# Altium schematic sheet Boost convertor.SchDoc
size A; SheetNumber: 1; SheetTotal: 1
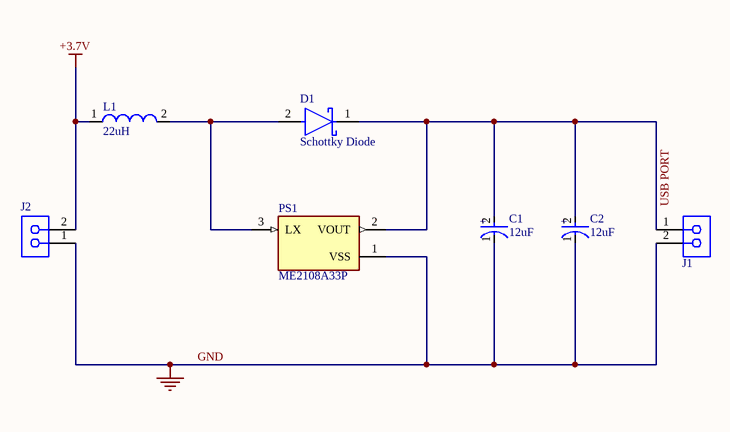
[diagram p0: Boost convertor.SchDoc]

## Parts
C1  12uF  [FP-RAD-TH-D_5_0_5-L_7_1-F-MFG]
C2  12uF  [FP-RAD-TH-D_5_0_5-L_7_1-F-MFG]
D1  Schottky Diode  [FP-DO-41-MFG]
J1  SSW-102-02-T-S  [SMTC-SSW-102-02-X-S]  (value not drawn)
J2  SSW-102-02-T-S  [SMTC-SSW-102-02-X-S]  (value not drawn)
L1  22uH  [WE-TIS 1111]
PS1  ME2108A33P  [CONV_ME2108A33P]

## Nets
+3.7V: J2.2 L1.1
GND: C1.1(C) C2.1(C) J1.2 J2.1 PS1.1(VSS)
USB PORT: C1.2(A) C2.2(A) D1.1(C) J1.1 PS1.2(VOUT)
NetD1_2: D1.2(A) L1.2 PS1.3(LX)

## Notes on the sheet
- (in symbol CMP-05427-000166-1) +

## Library data of the parts
C1 C2 = CMP-05427-000166-1: Aluminum Electrolytic Capacitors (Radial Lead Type) AEC-Q200 Qualified 12uF ±20% 35V; Impedance: 950mR; Leakage Current: 3uA; Ripple Current: 120mA; Lead Diameter: 0.45mm; Life (Hours): 1000Hour; Voltage: 35V; Lead Pitch: 2mm; Capacitance: 12uF; Radiation Hardening: No; Construction: RADIAL; RoHS Compliant: Yes; Voltage Rating: 35V; Length: 7mm; Min Operating Temperature: -55°C; Tolerance: 20%; Height - Seated (Max): 0.315inch; Height: 7mm; Case/Package: Radial; Termination: Radial; Diameter: 5mm; Packaging: Bulk; ESR (Equivalent Series Resistance): 950mR; Mount: Through Hole; Package Quantity: 200; Series: FC; Voltage Rating (DC): 35V; Max Operating Temperature: 105°C
D1 = CMP-12187-000037-1: DIODE SCHOTTKY 20V 1A DO41; Max Forward Surge Current (Ifsm): 25A; Forward Voltage: 450mV; Max Reverse Leakage Current: 500uA; Element Configuration: Single; Polarity: Standard; Capacitance: 110pF; Length: 5.2mm; Min Operating Temperature: -65°C; Series: -; Packaging: Cut Tape; Output Current: 1A; RoHS Compliant: Yes; Max Surge Current: 25A; Voltage Rating (DC): 20V; Number of Pins: 2; Width: 2.7mm; Max Reverse Voltage (DC): 20V; Height: 2.7mm; Weight: 0.01lb; Max Operating Temperature: 150°C; Current Rating: 1A; Lead Free: Lead Free; Case/Package: DO-41; Radiation Hardening: No; Package Quantity: 2000; Forward Current: 1A; Max Repetitive Reverse Voltage (Vrrm): 20V; Peak Non-Repetitive Surge Current: 25A; REACH SVHC: No SVHC; Average Rectified Current: 1A; Max Reverse Current: 500uA; Mount: Through Hole
J1 J2 = CMP-1023-00323-1: SQ Post Socket, Through-hole, Vertical, -55 to 105 degC, 2.54 mm Pitch, 2-Pin, Female, RoHS; Manufacturer: Samtec; Pitch: 2.54 mm; ComponentLink3Description: Package Specification; ComponentLink2Description: Datasheet; ComponentLink1Description: Manufacturer URL; PackageVersion: CA, 6/1987; DatasheetVersion: F-214; PackageDescription: Assembly, Socket Strip .016 X .031 Tail; ComponentLink2URL: http://www.samtec.com/documents/webfiles/pdf/SSW_TH.PDF; RoHS: True; ComponentLink3URL: http://www.samtec.com/documents/webfiles/cpdf/SSW-1XX-XX-XXX-X-XX-XXX-XX-MKT.pdf; ComponentLink1URL: http://www.samtec.com; PackageReference: SSW-102-02-X-S; Mounting Technology: Through-hole; Orientation: Vertical; Temperature Range: -55 to 105 degC; PartNumber: SSW-102-02-T-S
L1 = CMP-1406-00020-1: Shielded Radial Leaded Wire Wound Inductor WE-TIS, L=22.0 µH; PartNumber: 7447471220; Manufacturer: Wuerth Elektronik; Inductance: 22.0 ÂµH; ComponentLink2Description: Datasheet; PackageReference: WE-TIS 1111; ComponentLink1Description: Manufacturer URL; ComponentLink2URL: http://www.we-online.de/katalog/media/pdf/7447471220.pdf; ComponentLink1URL: http://www.we-online.com
PS1 = ME2108A33P: PFM Step-up Step-up Step-up Step-up DC/DC Converter; MF: Nanjing Micro One Electronics; Price: None; SnapEDA_Link: https://www.snapeda.com/parts/ME2108A33P/Nanjing%20Micro%20One%20Electronics/view-part/4258047/?ref=snap; MP: ME2108A33P; Value: *; Availability: Unavailable; Package: Package; Check_prices: https://www.snapeda.com/parts/ME2108A33P/Nanjing%20Micro%20One%20Electronics/view-part/4258047/?ref=eda